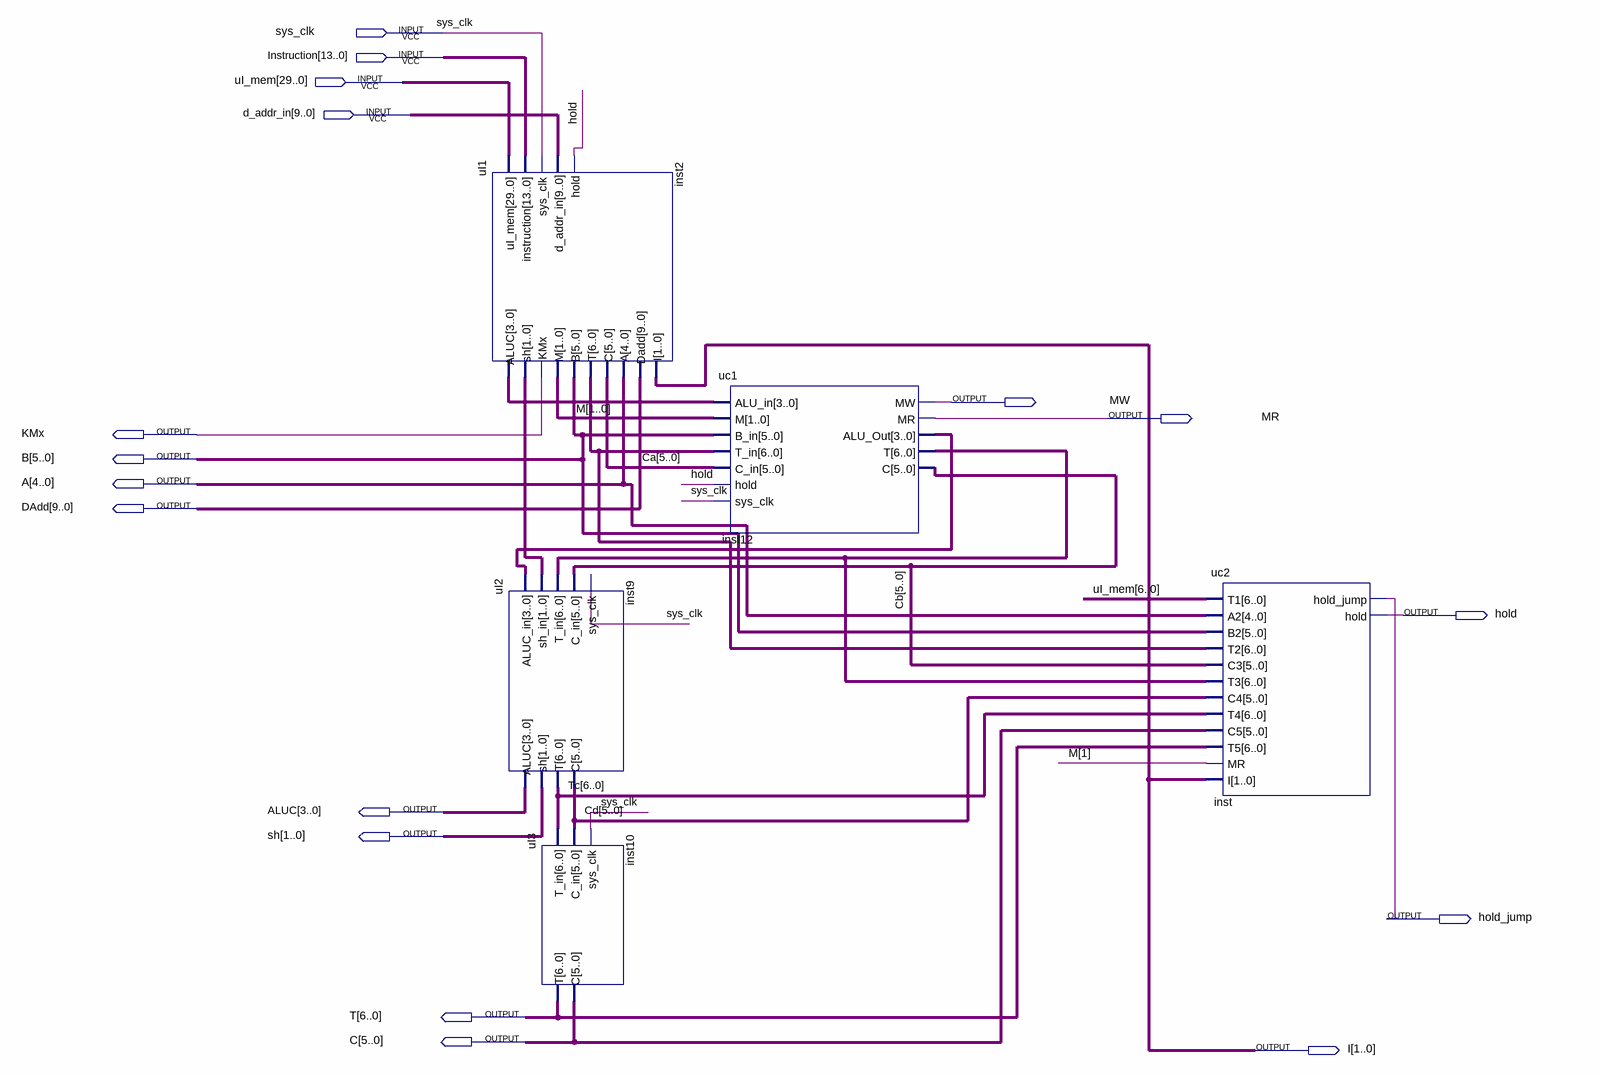
[diagram p0: schematic sheet]
// Quartus schematic uIHandler.bdf as structural Verilog: 5 symbols, 17 pins
module uIHandler (
  input  sys_clk,
  input  [13:0] Instruction,
  input  [29:0] uI_mem,
  input  [9:0] d_addr_in,
  output MW,
  output MR,
  output KMx,
  output [5:0] B,
  output [4:0] A,
  output [9:0] DAdd,
  output hold,
  output [3:0] ALUC,
  output [1:0] sh,
  output hold_jump,
  output [6:0] T,
  output [5:0] C,
  output [1:0] I
);

  wire [1:0] inst2_sh, M;
  wire [3:0] inst2_aluc, inst12_alu_out;
  wire [5:0] Ca, Cb, Cd;
  wire [6:0] inst2_t, inst12_t, Tc;

  uI1 inst2 (
    .uI_mem(uI_mem), .instruction(Instruction), .sys_clk(sys_clk), .d_addr_in(d_addr_in), .hold(hold),
    .ALUC(inst2_aluc), .sh(inst2_sh), .KMx(KMx), .M(M), .B(B), .T(inst2_t), .C(Ca), .A(A), .Dadd(DAdd), .I(I));
  uI2 inst9 (
    .ALUC_in(inst12_alu_out), .sh_in(inst2_sh), .T_in(inst12_t), .C_in(Cb), .sys_clk(sys_clk), .ALUC(ALUC),
    .sh(sh), .T(Tc), .C(Cd));
  uI3 inst10 (.T_in(Tc), .C_in(Cd), .sys_clk(sys_clk), .T(T), .C(C));
  uc1 inst12 (
    .ALU_in(inst2_aluc), .M(M), .B_in(B), .T_in(inst2_t), .C_in(Ca), .hold(hold), .sys_clk(sys_clk), .MW(MW),
    .MR(MR), .ALU_Out(inst12_alu_out), .T(inst12_t), .C(Cb));
  uc2 inst (
    .T1(uI_mem[6:0]), .A2(A), .B2(B), .T2(inst2_t), .C3(Cb), .T3(inst12_t), .C4(Cd), .T4(Tc), .C5(C), .T5(T),
    .MR(M[1]), .I(I), .hold_jump(hold_jump), .hold(hold));
endmodule
